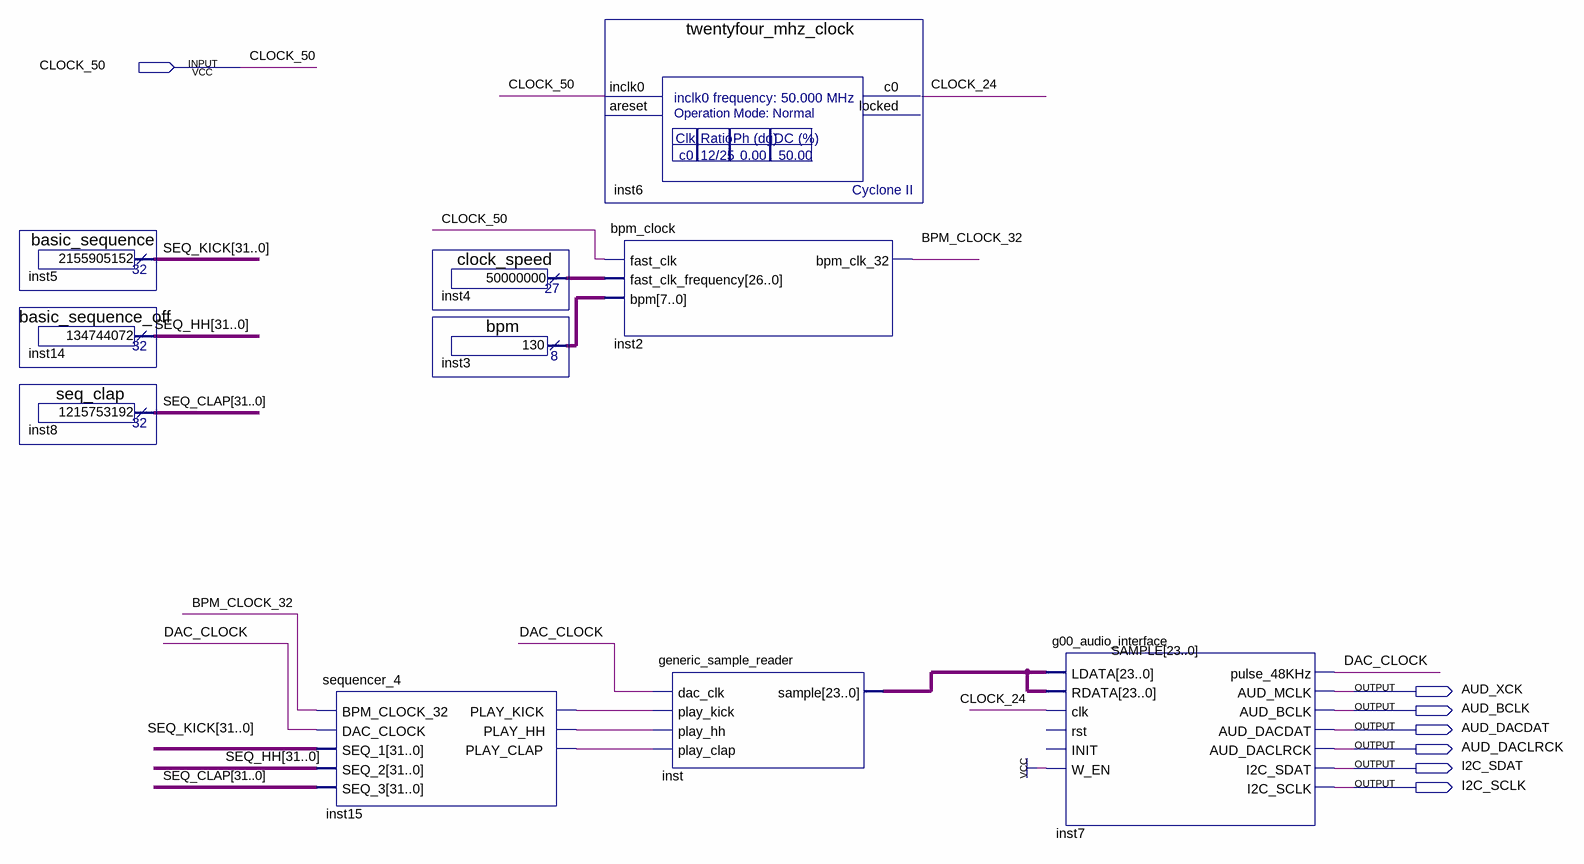
[diagram p0: schematic sheet]
// Quartus schematic main_too_large.bdf as structural Verilog: 10 symbols, 7 pins
module main_too_large (
  input  CLOCK_50,
  output AUD_XCK,
  output AUD_BCLK,
  output AUD_DACDAT,
  output AUD_DACLRCK,
  output I2C_SDAT,
  output I2C_SCLK
);

  wire BPM_CLOCK_32, CLOCK_24, DAC_CLOCK, inst15_play_clap, inst15_play_hh, inst15_play_kick;
  wire [7:0] inst3_result;
  wire [23:0] SAMPLE;
  wire [26:0] inst4_result;
  wire [31:0] SEQ_CLAP, SEQ_HH, SEQ_KICK;

  basic_sequence inst5 (.result(SEQ_KICK));
  basic_sequence_off inst14 (.result(SEQ_HH));
  seq_clap inst8 (.result(SEQ_CLAP));
  sequencer_4 inst15 (
    .BPM_CLOCK_32(BPM_CLOCK_32), .DAC_CLOCK(DAC_CLOCK), .SEQ_1(SEQ_KICK), .SEQ_2(SEQ_HH), .SEQ_3(SEQ_CLAP),
    .PLAY_KICK(inst15_play_kick), .PLAY_HH(inst15_play_hh), .PLAY_CLAP(inst15_play_clap));
  clock_speed inst4 (.result(inst4_result));
  bpm inst3 (.result(inst3_result));
  twentyfour_mhz_clock inst6 (.inclk0(CLOCK_50), .c0(CLOCK_24));  // open: areset, locked
  bpm_clock inst2 (
    .fast_clk(CLOCK_50), .fast_clk_frequency(inst4_result), .bpm(inst3_result), .bpm_clk_32(BPM_CLOCK_32));
  generic_sample_reader inst (
    .dac_clk(DAC_CLOCK), .play_kick(inst15_play_kick), .play_hh(inst15_play_hh),
    .play_clap(inst15_play_clap), .sample(SAMPLE));
  g00_audio_interface inst7 (
    .LDATA(SAMPLE), .RDATA(SAMPLE), .clk(CLOCK_24), .W_EN(1'b1), .pulse_48KHz(DAC_CLOCK), .AUD_MCLK(AUD_XCK),
    .AUD_BCLK(AUD_BCLK), .AUD_DACDAT(AUD_DACDAT), .AUD_DACLRCK(AUD_DACLRCK), .I2C_SDAT(I2C_SDAT),
    .I2C_SCLK(I2C_SCLK));  // open: rst, INIT
endmodule
